# EAGLE design EN715_ExpansionBoard_ver1_1 (EAGLE 9.6.2)
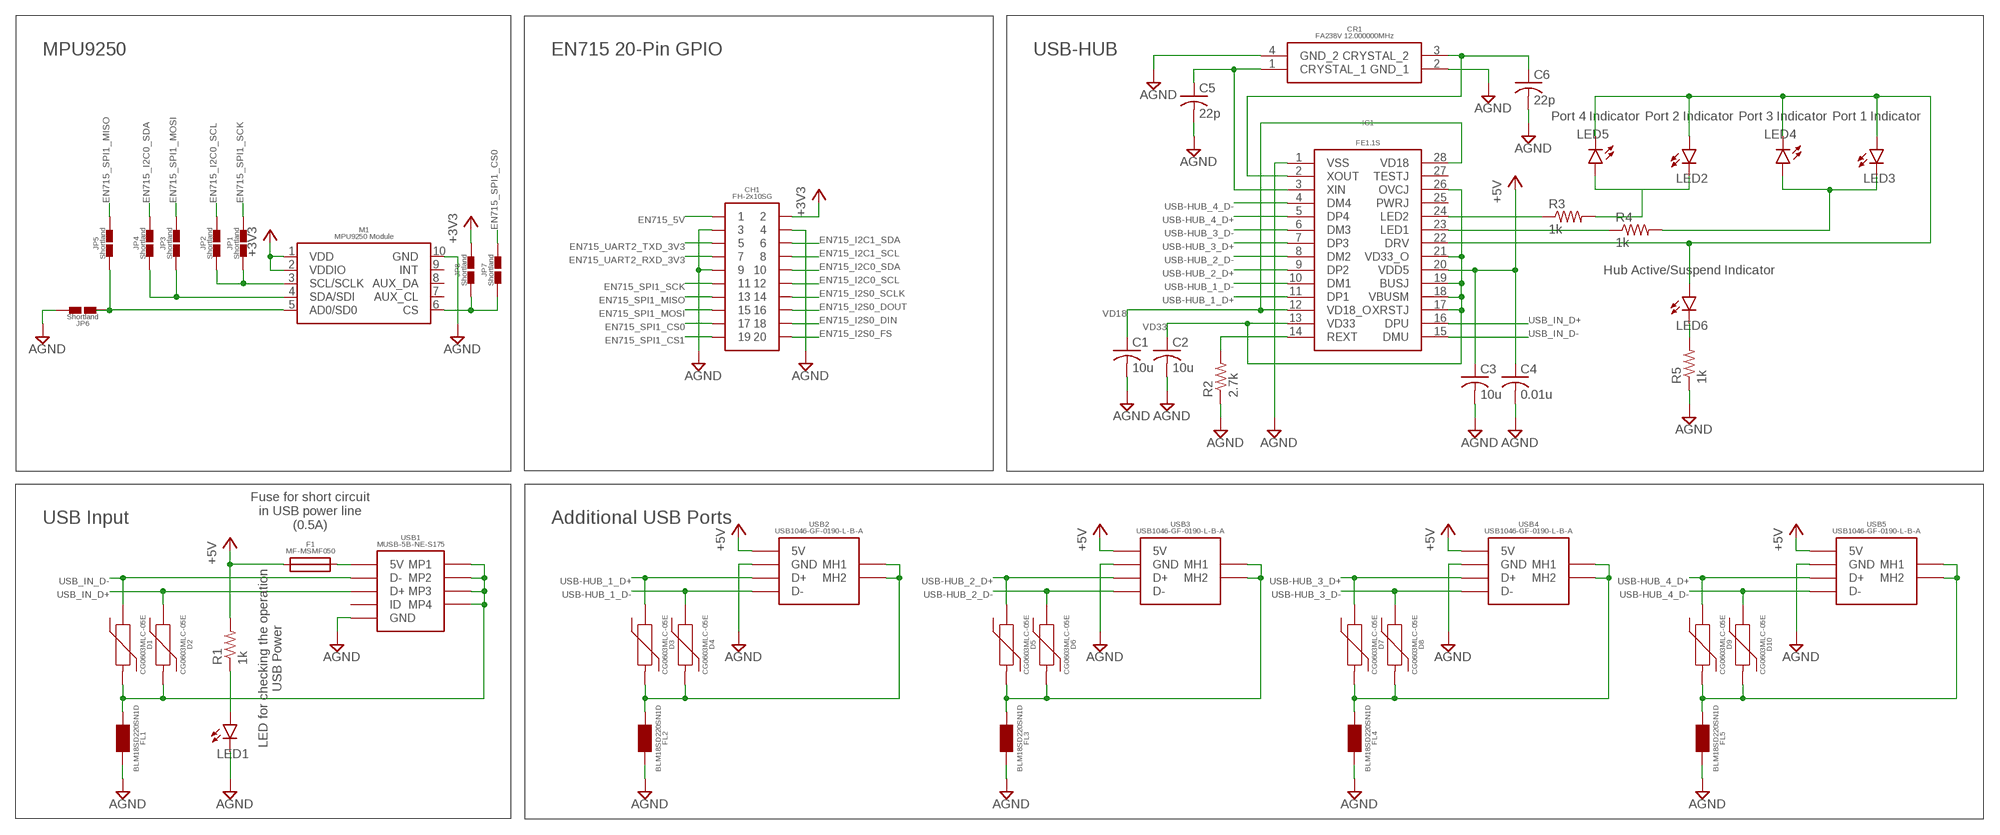
[diagram p0: schematic, sheet 1]

## Parts
C1  10u  C-USC0603  [C0603]
C2  10u  C-USC0603  [C0603]
C3  10u  C-USC0603  [C0603]
C4  0.01u  C-USC0603  [C0603]
C5  22p  C-USC0603  [C0603]
C6  22p  C-USC0603  [C0603]
CH1  2X10  [2X10]
CR1  FA238V_12.000000MHZ  [FA238V]
D1  CG0603MLC-05E  [CG0603MLC-05E]
D2  CG0603MLC-05E  [CG0603MLC-05E]
D3  CG0603MLC-05E  [CG0603MLC-05E]
D4  CG0603MLC-05E  [CG0603MLC-05E]
D5  CG0603MLC-05E  [CG0603MLC-05E]
D6  CG0603MLC-05E  [CG0603MLC-05E]
D7  CG0603MLC-05E  [CG0603MLC-05E]
D8  CG0603MLC-05E  [CG0603MLC-05E]
D9  CG0603MLC-05E  [CG0603MLC-05E]
D10  CG0603MLC-05E  [CG0603MLC-05E]
F1  MF-MSMF050  [MF-MSMF050]
FL1  BLM18SD220SN1D  [BLM18SD220SN1D]
FL2  BLM18SD220SN1D  [BLM18SD220SN1D]
FL3  BLM18SD220SN1D  [BLM18SD220SN1D]
FL4  BLM18SD220SN1D  [BLM18SD220SN1D]
FL5  BLM18SD220SN1D  [BLM18SD220SN1D]
IC1  FE1.1S  [FE1.1S]
JP1  SHORTLAND  [SHORTLAND]
JP2  SHORTLAND  [SHORTLAND]
JP3  SHORTLAND  [SHORTLAND]
JP4  SHORTLAND  [SHORTLAND]
JP5  SHORTLAND  [SHORTLAND]
JP6  SHORTLAND  [SHORTLAND]
JP7  SHORTLAND  [SHORTLAND]
JP8  SHORTLAND  [SHORTLAND]
LED1  LEDSML0603  [SML0603]
LED2  LEDSML0603  [SML0603]
LED3  LEDSML0603  [SML0603]
LED4  LEDSML0603  [SML0603]
LED5  LEDSML0603  [SML0603]
LED6  LEDSML0603  [SML0603]
M1  MPU9250_MODULE  [MPU9250_MODULE]
R1  1k  R-US_R0603  [R0603]
R2  2.7k  R-US_R0603  [R0603]
R3  1k  R-US_R0603  [R0603]
R4  1k  R-US_R0603  [R0603]
R5  1k  R-US_R0603  [R0603]
USB1  MINI_USB_B_SMD  [MINI_USB_B_SMD]
USB2  USB_A_X1_SMD  [USB_A_X1_SMD]
USB3  USB_A_X1_SMD  [USB_A_X1_SMD]
USB4  USB_A_X1_SMD  [USB_A_X1_SMD]
USB5  USB_A_X1_SMD  [USB_A_X1_SMD]

## Nets
+3V3 [USB-Power]: CH1.2 JP8.2 M1.1(VDD) M1.2(VDDIO)
+5V [USB-Power]: C3.1 C4.1 F1.1 IC1.20(VDD5) R1.2 USB2.1(5V) USB3.1(5V) USB4.1(5V) USB5.1(5V)
AGND [USB-Power]: C1.2 C2.2 C3.2 C4.2 C5.2 C6.2 CH1.3 CH1.4 CH1.9 CR1.2(GND_1) CR1.4(GND_2) FL1.2 FL2.2 FL3.2 FL4.2 FL5.2 IC1.1(VSS) JP6.2 LED1.C M1.10(GND) R2.1 R5.1 USB1.5(GND) USB2.4(GND) USB3.4(GND) USB4.4(GND) USB5.4(GND)
B_FUSE_USB_MINI_B [USB-Power]: F1.2 USB1.1(5V)
EN715_5V [USB-Power]: CH1.1
EN715_I2C0_SCL [USB-Data]: CH1.12 JP2.2
EN715_I2C0_SDA [USB-Data]: CH1.10 JP4.2
EN715_I2C1_SCL [USB-Data]: CH1.8
EN715_I2C1_SDA [USB-Data]: CH1.6
EN715_I2S0_DIN [USB-Data]: CH1.18
EN715_I2S0_DOUT [USB-Data]: CH1.16
EN715_I2S0_FS [USB-Data]: CH1.20
EN715_I2S0_SCLK [USB-Data]: CH1.14
EN715_SPI1_CS0 [USB-Data]: CH1.17 JP7.2
EN715_SPI1_CS1 [USB-Data]: CH1.19
EN715_SPI1_MISO [USB-Data]: CH1.13 JP5.2
EN715_SPI1_MOSI [USB-Data]: CH1.15 JP3.2
EN715_SPI1_SCK [USB-Data]: CH1.11 JP1.2
EN715_UART2_RXD_3V3 [USB-Data]: CH1.7
EN715_UART2_TXD_3V3 [USB-Data]: CH1.5
FE1.1S_DRV [USB-Power]: IC1.22(DRV) LED2.A LED3.A LED4.C LED5.C LED6.A
FE1.1S_DRV_LED_A [USB-Power]: LED6.C R5.2
FE1.1S_LED1_A [USB-Power]: LED3.C LED4.A R4.2
FE1.1S_LED_1_B [USB-Power]: IC1.23(LED1) R4.1
FE1.1S_LED_2_A [USB-Power]: LED2.C LED5.A R3.2
FE1.1S_LED_2_B [USB-Power]: IC1.24(LED2) R3.1
LED_USBIN [USB-Power]: LED1.A R1.1
MPU9250_AD0/SD0 [USB-Data]: JP5.1 JP6.1 M1.5(AD0/SD0)
MPU9250_CS [USB-Data]: JP7.1 JP8.1 M1.6(CS)
MPU9250_SCL/SCLK [USB-Data]: JP1.1 JP2.1 M1.3(SCL/SCLK)
MPU9250_SDA/SDI [USB-Data]: JP3.1 JP4.1 M1.4(SDA/SDI)
REXT_FE1.1S [USB-Data]: IC1.14(REXT) R2.2
USB-HUB_1_D+ [USB-Data]: D3.1 IC1.11(DP1) USB2.3(D+)
USB-HUB_1_D- [USB-Data]: D4.1 IC1.10(DM1) USB2.2(D-)
USB-HUB_2_D+ [USB-Data]: D5.1 IC1.9(DP2) USB3.3(D+)
USB-HUB_2_D- [USB-Data]: D6.1 IC1.8(DM2) USB3.2(D-)
USB-HUB_3_D+ [USB-Data]: D7.1 IC1.7(DP3) USB4.3(D+)
USB-HUB_3_D- [USB-Data]: D8.1 IC1.6(DM3) USB4.2(D-)
USB-HUB_4_D+ [USB-Data]: D9.1 IC1.5(DP4) USB5.3(D+)
USB-HUB_4_D- [USB-Data]: D10.1 IC1.4(DM4) USB5.2(D-)
USB_A_1_SHIELD [USB-Power]: D3.2 D4.2 FL2.1 USB2.MH1 USB2.MH2
USB_A_2_SHIELD [USB-Power]: D5.2 D6.2 FL3.1 USB3.MH1 USB3.MH2
USB_A_3_SHIELD [USB-Power]: D7.2 D8.2 FL4.1 USB4.MH1 USB4.MH2
USB_A_4_SHIELD [USB-Power]: D9.2 D10.2 FL5.1 USB5.MH1 USB5.MH2
USB_IN_D+ [USB-Data]: D2.1 IC1.16(DPU) USB1.3(D+)
USB_IN_D- [USB-Data]: D1.1 IC1.15(DMU) USB1.2(D-)
USB_MINI_B_SHIELD [USB-Power]: D1.2 D2.2 FL1.1 USB1.MP1 USB1.MP2 USB1.MP3 USB1.MP4
VD18 [USB-Power]: C1.1 IC1.12(VD18_O) IC1.28(VD18)
VD33 [USB-Power]: C2.1 IC1.13(VD33) IC1.17(XRSTJ) IC1.18(VBUSM) IC1.19(BUSJ) IC1.21(VD33_O) IC1.26(OVCJ)
XIN_FE1.1S [USB-Data]: C5.1 CR1.1(CRYSTAL_1) IC1.3(XIN)
XOUT_FE1.1S [USB-Data]: C6.1 CR1.3(CRYSTAL_2) IC1.2(XOUT)
Unconnected: IC1.25(PWRJ) IC1.27(TESTJ) M1.7(AUX_CL) M1.8(AUX_DA) M1.9(INT) USB1.4(ID)

## Notes on the sheet
- MPU9250 | EN715 20-Pin GPIO | USB-HUB
- Port 4 Indicator | Port 2 Indicator | Port 3 Indicator | Port 1 Indicator
- Hub Active/Suspend Indicator
- USB Input
- Fuse for short circuit
  in USB power line
  (0.5A)
- Additional USB Ports
- LED for checking the operation
  USB Power

## Library data of the parts
C1-C6 = rcl:C-US: CAPACITOR, American symbol; SPICEPREFIX: C
CH1 = Pin_socket:2X10
CR1 = FA238V:FA238V_12.000000MHZ
D1-D10 = CG0603MLC-05E:CG0603MLC-05E
F1 = MF-MSMF:MF-MSMF050
FL1-FL5 = BLM18SD220SN1D:BLM18SD220SN1D
IC1 = FE1.1S:FE1.1S
JP1-JP8 = Shortland:SHORTLAND
LED1-LED6 = led:LED: LED OSRAM: - CHIPLED LG R971, LG N971, LY N971, LG Q971, LY Q971, LO R971, LY R971 LH N974, LH R974 LS Q976, LO Q976, LY Q976 LO Q996 - Hyper CHIPLED LW Q18S LB Q993, LB Q99A, LB R99A - SideLED LS A670, LO A670, LY A670, LG A670, LP A670 LB A673, LV A673, LT A673, LW A673 LH A674 LY A675 LS A676, LA A676, LO A676, LY A676, LW A676 LS A679, LY A679, LG A679 - Hyper Micro SIDELED® LS Y876, LA Y876, LO Y876, LY Y876 LT Y87S - SmartLED LW L88C, LW L88S LB L89C, LB L89S, LG L890 LS L89K, LO L89K, LY L89K LS L896, LA L896, LO L896, LY L896 - TOPLED LS T670, LO T670, LY T670, LG T670, LP T670 LSG T670, LSP T670, LSY T670, LOP T670, LYG T670 LG T671, LOG T671, LSG T671 LB T673, LV T673, LT T673, LW T673 LH T674 LS T676, LA T676, LO T676, LY T676, LB T676, LH T676, LSB T676, LW T676 LB T67C, LV T67C, LT T67C, LS T67K, LO T67K, LY T67K, LW E67C LS E67B, LA E67B, LO E67B, LY E67B, LB E67C, LV E67C, LT E67C LW T67C LS T679, LY T679, LG T679 LS T770, LO T770, LY T770, LG T770, LP T770 LB T773, LV T773, LT T773, LW T773 LH T774 LS E675, LA E675, LY E675, LS T675 LS T776, LA T776, LO T776, LY T776, LB T776 LHGB T686 LT T68C, LB T68C - Hyper Mini TOPLED® LB M676 - Mini TOPLED Santana® LG M470 LS M47K, LO M47K, LY M47K Source: http://www.osram.convergy.de LUXEON: - LUMILED® LXK2-PW12-R00, LXK2-PW12-S00, LXK2-PW14-U00, LXK2-PW14-V00 LXK2-PM12-R00, LXK2-PM12-S00, LXK2-PM14-U00 LXK2-PE12-Q00, LXK2-PE12-R00, LXK2-PE12-S00, LXK2-PE14-T00, LXK2-PE14-U00 LXK2-PB12-K00, LXK2-PB12-L00, LXK2-PB12-M00, LXK2-PB14-N00, LXK2-PB14-P00, LXK2-PB14-Q00 LXK2-PR12-L00, LXK2-PR12-M00, LXK2-PR14-Q00, LXK2-PR14-R00 LXK2-PD12-Q00, LXK2-PD12-R00, LXK2-PD12-S00 LXK2-PH12-R00, LXK2-PH12-S00 LXK2-PL12-P00, LXK2-PL12-Q00, LXK2-PL12-R00 Source: www.luxeon.com KINGBRIGHT: KA-3528ASYC Source: www.kingbright.com
M1 = Strawberry-Linux_MPUP250_Module:MPU9250_MODULE
R1-R5 = rcl:R-US_: RESISTOR, American symbol; SPICEPREFIX: R
USB1 = USB_Connector:MINI_USB_B_SMD
USB2-USB5 = USB_Connector:USB_A_X1_SMD

## Net classes
1 USB-Data: width 0.254 mm, drill 0.127 mm, clearance 0.203 mm
2 USB-Power: width 0.254 mm, drill 0.127 mm, clearance 0.203 mm

## Board
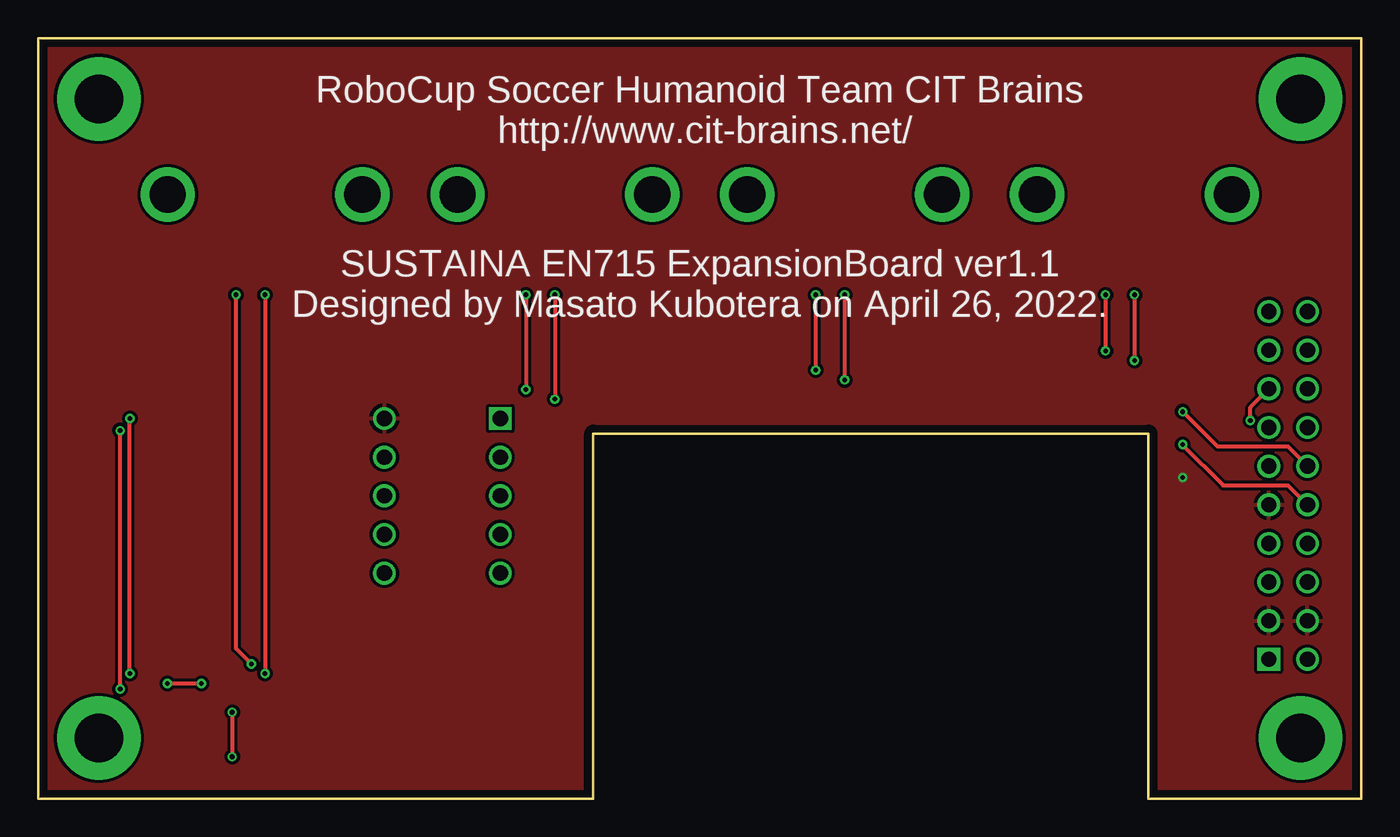
[diagram p1: board, top side]
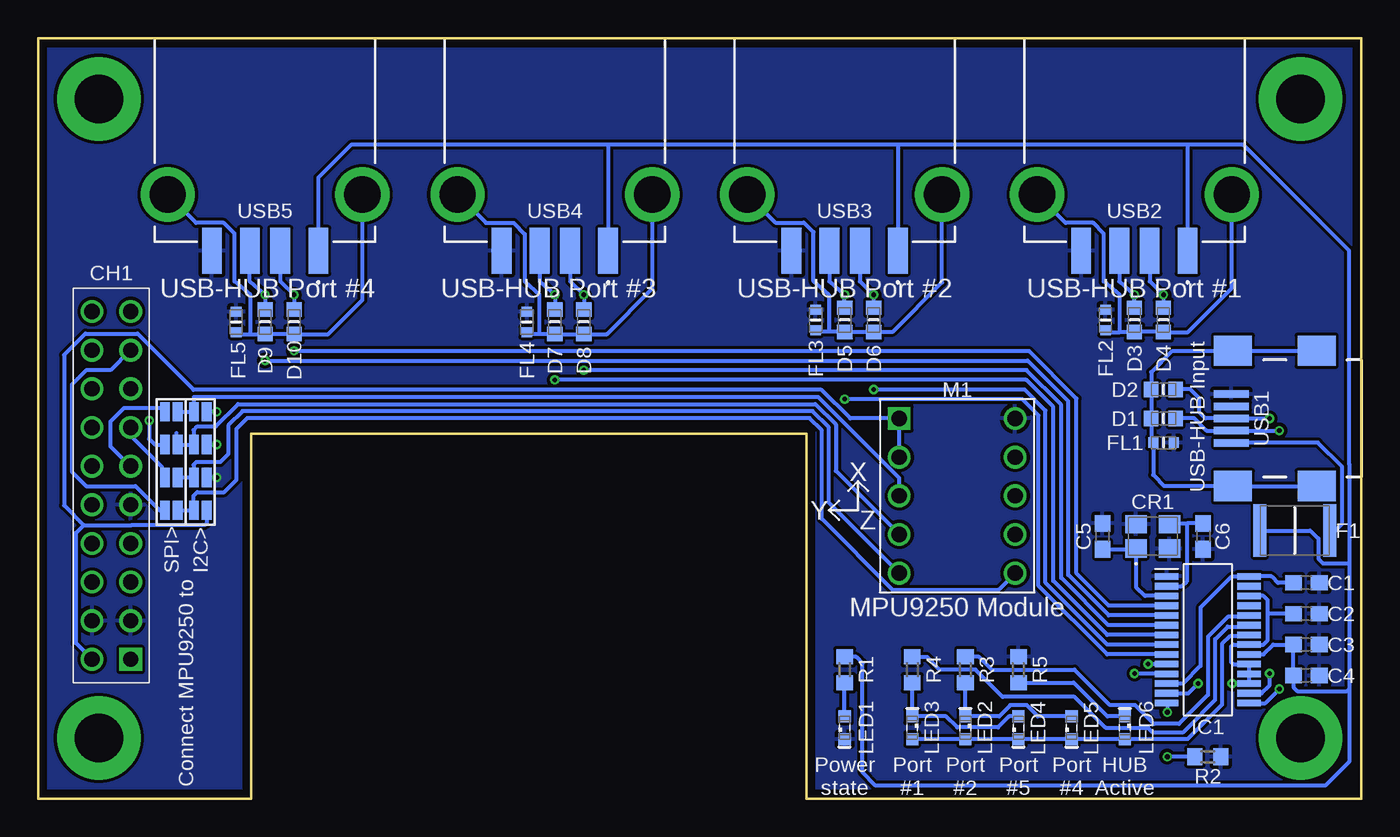
[diagram p2: board, bottom side, seen from below]

Size 87 x 50 mm. Coordinates in mm from the lower left corner, seen from the top.
Outline: 0,50 0,0 36.5,0 36.5,24 73,24 73,0 87,0 87,50 0,50
Copper layers (1*16): Top 0.035mm / dielectric 1.6mm / Bottom 0.035mm
Design rules "Elecrow_2-layer_PCB_eagle_rule": minimum track width 6mil, minimum drill 12mil, track to track 6mil, track to pad 6mil, pad to pad 6mil, via to via 8mil, smd to smd 0mil, copper to edge 20mil, drill to drill 10mil, minimum pad ring 6mil, minimum via ring 6mil, stop-mask expansion 0mil, vias tented up to drill 100mil, thermal gap 10mil

### Footprints (pad centres in the part's own frame; a part is rotated, then mirrored left to right if it is on the bottom)
C0603 = smd 1.1 x 1: 1 -0.85,0; 2 0.85,0
2X10 = drill 1 pad 1.5 square: 1 -11.43,-1.27 | drill 1 pad 1.5: 2 -11.43,1.27; 3 -8.89,-1.27; 4 -8.89,1.27; 5 -6.35,-1.27; 6 -6.35,1.27; 7 -3.81,-1.27; 8 -3.81,1.27; 9 -1.27,-1.27; 10 -1.27,1.27; 11 1.27,-1.27; 12 1.27,1.27; 13 3.81,-1.27; 14 3.81,1.27; 15 6.35,-1.27; 16 6.35,1.27; 17 8.89,-1.27; 18 8.89,1.27; 19 11.43,-1.27; 20 11.43,1.27
FA238V = smd 1.4 x 1.2: 1 -1.1,-0.8; 2 1.1,-0.8; 3 1.1,0.8; 4 -1.1,0.8
CG0603MLC-05E = smd 0.95 x 1: 1 -0.8,0; 2 0.8,0
MF-MSMF050 = smd 0.85 x 3.43: 1 -2.3,0; 2 2.3,0
BLM18SD220SN1D = smd 0.65 x 0.7: 1 -0.675,0; 2 0.675,0
FE1.1S = smd 1.525 x 0.44: 1 -2.712,4.16; 2 -2.712,3.52; 3 -2.712,2.88; 4 -2.712,2.24; 5 -2.712,1.6; 6 -2.712,0.96; 7 -2.712,0.32; 8 -2.712,-0.32; 9 -2.712,-0.96; 10 -2.712,-1.6; 11 -2.712,-2.24; 12 -2.712,-2.88; 13 -2.712,-3.52; 14 -2.712,-4.16; 15 2.712,-4.16; 16 2.712,-3.52; 17 2.712,-2.88; 18 2.712,-2.24; 19 2.712,-1.6; 20 2.712,-0.96; 21 2.712,-0.32; 22 2.712,0.32; 23 2.712,0.96; 24 2.712,1.6; 25 2.712,2.24; 26 2.712,2.88; 27 2.712,3.52; 28 2.712,4.16
SHORTLAND = smd 0.635 x 1.27: 1 -0.419,0; 2 0.419,0
SML0603 = smd 0.8 x 0.8: A 0.75,0; C -0.75,0
MPU9250_MODULE = drill 1 square: 1 -5.08,-3.81 | drill 1: 2 -2.54,-3.81; 3 0,-3.81; 4 2.54,-3.81; 5 5.08,-3.81; 6 5.08,3.81; 7 2.54,3.81; 8 0,3.81; 9 -2.54,3.81; 10 -5.08,3.81
R0603 = smd 1 x 1.1: 1 -0.85,0; 2 0.85,0
MINI_USB_B_SMD = smd 0.5 x 2.3: 1 -1.6,8.55; 2 -0.8,8.55; 3 0,8.55; 4 0.8,8.55; 5 1.6,8.55 | smd 2 x 2.5: MP1 -4.45,8.45; MP2 4.45,8.45; MP3 4.45,2.95; MP4 -4.45,2.95
USB_A_X1_SMD = smd 1.3 x 3: 1 -3.5,13.98; 2 -1,13.98; 3 1,13.98; 4 3.5,13.98 | drill 2.38 pad 3.57: MH1 -6.4,10.28; MH2 6.4,10.28

### Placement (x,y rotation side)
C1  3.62,14.21 0 bottom
C2  3.62,12.17 0 bottom
C3  3.62,10.14 0 bottom
C4  3.62,8.11 0 bottom
C5  17.02,17.25 90 bottom
C6  10.42,17.25 270 bottom
CH1  82.18,20.6 90 bottom
CR1  13.72,17.25 0 bottom
D1  13.02,25 180 bottom
D2  13.02,26.91 180 bottom
D3  14.93,31.48 270 bottom
D4  13.02,31.48 270 bottom
D5  33.98,31.48 270 bottom
D6  32.07,31.48 270 bottom
D7  53.02,31.35 270 bottom
D8  51.12,31.35 270 bottom
D9  72.08,31.35 270 bottom
D10  70.17,31.35 270 bottom
F1  4.38,17.63 0 bottom
FL1  13.02,23.41 0 bottom
FL2  16.83,31.48 90 bottom
FL3  35.88,31.48 90 bottom
FL4  54.87,31.35 90 bottom
FL5  73.98,31.35 90 bottom
IC1  10.1,10.46 0 bottom
JP1  78.23,25.44 180 bottom
JP2  76.33,25.44 0 bottom
JP3  78.23,23.29 180 bottom
JP4  76.33,23.29 0 bottom
JP5  78.23,21.13 180 bottom
JP6  76.33,21.13 0 bottom
JP7  78.23,18.97 180 bottom
JP8  76.33,18.97 0 bottom
LED1  33.98,4.68 90 bottom
LED2  26.04,4.68 270 bottom
LED3  29.53,4.68 270 bottom
LED4  22.55,4.68 90 bottom
LED5  19.05,4.68 90 bottom
LED6  15.56,4.68 270 bottom
M1  26.58,19.92 270 bottom
R1  33.98,8.49 90 bottom
R2  10.1,2.77 180 bottom
R3  26.04,8.49 270 bottom
R4  29.53,8.49 270 bottom
R5  22.55,8.49 270 bottom
USB1  0,25 90 bottom
USB2  14.93,50 180 bottom
USB3  33.98,50 180 bottom
USB4  53.02,50 180 bottom
USB5  72.08,50 180 bottom

### Tracks (layer width: path | path; a pad name or v marks a point on that pad's centre or on a via)
+3V3
  Bottom 0.254: M1.2 M1.1 33.61,25 35.49,26.89 76.78,26.89 80.46,30.57 83.9,30.57 85.28,29.18 85.28,19.29 84,18 | 84,18 80.84,18 | JP8.2 75.91,18.13 76.05,18 80.84,18 | 80.83,18 80.84,18 | 84,18 84.53,17.46 84.53,10.25 CH1.2
+5V
  Bottom 0.254: IC1.20 6.44,9.5 5.8,10.14 C3.1 C4.1 4.47,7.35 4.2,7.08 0.95,7.08 0.81,7.22 | R1.2 33.21,9.34 32.8,8.93 32.8,1.74 31.94,0.88 7.44,0.88 7.43,0.87 2.39,0.87 0.81,2.45 0.81,7.22 | 30.42,42.98 11.42,42.98 11.4,42.98 | 30.42,42.98 49.52,42.98 | USB5.1 68.58,40.83 66.42,42.98 49.52,42.98 | 30.42,42.98 30.48,42.92 USB3.1 | 49.52,42.98 USB4.1 | 11.4,42.98 7.78,42.98 0.81,36.02 0.81,22.01 | 0.81,22.01 0.83,22.03 | 0.81,22.01 0.81,15.47 | 0.81,15.47 0.81,7.22 | F1.1 3.37,17.63 2.84,17.11 2.84,15.78 2.53,15.47 0.81,15.47 | USB2.1 11.42,42.95 11.4,42.98
AGND  (via drill 0.3)
  Bottom 0.254: 2.8,12.49 C2.2
  other vias: 75.25,21.13
  pour Top: -0.95,51.03 -0.95,-1.04 37.42,-1.04 37.42,23.09 72.44,23.09 72.44,-1.04 87.95,-1.04 87.95,51.03
  pour Bottom: -1.59,51.67 -1.59,-1.67 38.05,-1.67 38.05,22.46 71.81,22.46 71.81,-1.67 88.59,-1.67 88.59,51.67
B_FUSE_USB_MINI_B
  Bottom 0.254: USB1.1 8.26,23.41 2.86,23.41 1.27,21.82 1.27,18.08 1.72,17.63 F1.2
EN715_I2C0_SCL  (via drill 0.3)
  Top 0.254: v75.25,25.45 77.55,23.15 82.18,23.15 83.19,22.14 CH1.12
  Bottom 0.254: v75.25,25.45 JP2.2
EN715_I2C0_SDA  (via drill 0.3)
  Top 0.254: v75.25,23.29 75.24,23.29 77.91,20.61 82.17,20.61 CH1.10
  Bottom 0.254: JP4.2 v75.25,23.29
EN715_SPI1_CS0
  Bottom 0.254: JP7.2 79,18.97 80.58,20.55 83.82,20.55 84.78,21.51 84.78,27.22 83.82,28.18 82.23,28.18 80.97,29.45 CH1.17
EN715_SPI1_MISO
  Bottom 0.254: CH1.13 80.91,23.86 78.87,21.82 78.87,21.19 JP5.2
EN715_SPI1_MOSI  (via drill 0.3)
  Top 0.254: CH1.15 79.69,25.73 v79.69,24.87
  Bottom 0.254: JP3.2 79.31,23.29 79.69,23.67 v79.69,24.87
EN715_SPI1_SCK
  Bottom 0.254: JP1.2 78.91,25.7 81.35,25.7 82.23,24.81 82.23,23.16 80.95,21.87 CH1.11
FE1.1S_DRV
  Bottom 0.254: LED3.A LED2.A LED4.C LED5.C LED6.A 11.43,3.93 9.17,6.2 9.17,10.19 8.67,10.69 7.48,10.69 IC1.22
FE1.1S_DRV_LED_A
  Bottom 0.254: R5.2 18.91,7.64 16.7,5.43 LED6.C
FE1.1S_LED1_A
  Bottom 0.254: LED4.A 23.16,5.43 23.9,4.7 26.57,4.7 27.3,5.43 LED3.C R4.2
FE1.1S_LED_1_B
  Bottom 0.254: IC1.23 7.48,11.33 8.79,11.33 9.62,10.5 9.62,6.51 11.4,4.68 11.7,4.39 13.74,4.39 14.04,4.68 16.83,4.68 18.86,6.71 23.59,6.71 25.37,8.49 27.73,8.49 28.56,9.34 R4.1
FE1.1S_LED_2_A
  Bottom 0.254: LED5.A 21.28,5.43 22.01,6.16 23.08,6.16 23.81,5.43 LED2.C R3.2
FE1.1S_LED_2_B
  Bottom 0.254: IC1.24 7.48,11.97 8.8,11.97 10.1,10.67 10.1,6.84 12,4.93 13.64,4.93 14.87,6.16 16.53,6.16 18.86,8.49 24.3,8.49 25.15,9.34 R3.1
LED_USBIN
  Bottom 0.254: LED1.A R1.1
MPU9250_AD0/SD0
  Bottom 0.254: JP5.1 77.81,21.1 77.8,21.09 77.77,21.13 JP6.1 | 76.65,21.19 JP6.1 | M1.5 35.02,19.47 35.02,24.42 36.09,25.49 73.56,25.49 74.49,24.55 74.49,22.65 75,22.14 76.58,22.14 76.77,21.95 76.77,21.13 JP6.1
MPU9250_CS
  Bottom 0.254: 77.92,18.97 JP7.1 JP8.1 76.77,18.99 76.77,19.92 76.53,20.16 74.75,20.16 73.97,20.95 73.97,24.3 73.24,25.02 36.27,25.02 35.48,24.22 35.48,18.4 30.84,13.76 23.85,13.76 M1.6
MPU9250_SCL/SCLK
  Bottom 0.254: 77.92,25.45 JP1.1 JP2.1 | 76.65,25.64 JP2.1 | M1.3 30.39,21.09 35.72,26.42 76.73,26.42 76.75,26.41 JP2.1
MPU9250_SDA/SDI
  Bottom 0.254: 77.92,24.05 77.92,23.41 JP3.1 JP4.1 76.77,23.31 76.77,24.24 76.53,24.48 75.32,24.48 73.85,25.95 35.89,25.95 34.56,24.61 34.56,21.55 M1.4
REXT_FE1.1S  (via drill 0.3)
  Top 0.254: v12.77,5.7 v12.77,2.77
  Bottom 0.254: IC1.14 12.77,6.25 v12.77,5.7 | R2.2 v12.77,2.77
S$1  (via drill 3.2 pad 5.5)
  other vias: 4,46
S$2  (via drill 3.2 pad 5.5)
  other vias: 83,46
S$3  (via drill 3.2 pad 5.5)
  other vias: 83,4
S$4  (via drill 3.2 pad 5.5)
  other vias: 4,4
USB-HUB_1_D+  (via drill 0.3)
  Top 0.254: v14.93,33.13 v14.93,8.24
  Bottom 0.254: 12.96,8.17 IC1.11 14.91,8.22 v14.93,8.24 | USB2.3 15.93,34.02 v14.93,33.13 D3.1
USB-HUB_1_D-  (via drill 0.3)
  Top 0.254: 13.02,9.87 v13.02,33.13 | 13.02,9.87 | v14.04,8.86 13.02,9.87
  Bottom 0.254: 13.91,36 USB2.2 13.93,34.02 v13.02,33.13 D4.1 | IC1.10 v14.04,8.86
USB-HUB_2_D+  (via drill 0.3)
  Top 0.254: v33.98,33.13 v33.98,26.27
  Bottom 0.254: IC1.9 16.72,9.5 21.22,14 21.22,25.2 22.29,26.27 v33.98,26.27 | D5.1 v33.98,33.13 34.98,34.02 USB3.3
USB-HUB_2_D-  (via drill 0.3)
  Top 0.254: v32.07,33.13 v32.07,26.91
  Bottom 0.254: 32.7,35.8 USB3.2 32.98,34.02 v32.07,33.13 D6.1 | IC1.8 16.71,10.14 20.77,14.19 20.77,25.51 22.16,26.91 v32.07,26.91
USB-HUB_3_D+  (via drill 0.3)
  Top 0.254: v53.02,33.13 v53.02,27.54
  Bottom 0.254: 53.98,36.11 USB4.3 54.02,34.02 v53.02,33.13 D7.1 53.34,32.3 | 12.96,10.71 IC1.7 16.71,10.78 20.26,14.33 20.26,25.76 22.04,27.54 v53.02,27.54
USB-HUB_3_D-  (via drill 0.3)
  Top 0.254: v51.12,33.13 v51.12,28.18
  Bottom 0.254: USB4.2 52.02,34.02 v51.12,33.13 D8.1 | IC1.6 16.62,11.42 19.73,14.53 19.73,25.89 22.02,28.18 v51.12,28.18
USB-HUB_4_D+  (via drill 0.3)
  Top 0.254: v72.08,33.13 v72.08,28.81
  Bottom 0.254: D9.1 v72.08,33.13 73.08,34.02 USB5.3 73.03,36.11 73.03,37.38 | IC1.5 16.62,12.06 19.27,14.72 19.27,26.14 21.94,28.81 v72.08,28.81
USB-HUB_4_D-  (via drill 0.3)
  Top 0.254: v70.17,33.13 v70.17,29.45
  Bottom 0.254: D10.1 v70.17,33.13 71.08,34.02 USB5.2 70.81,36.11 | IC1.4 16.61,12.7 18.74,14.83 18.74,26.31 21.88,29.45 v70.17,29.45
USB_A_1_SHIELD
  Bottom 0.254: 15.9,30.68 D3.2 14.86,30.71 13.27,30.71 D4.2 11.41,30.68 8.52,33.56 USB2.MH1 | USB2.MH2 19.45,37.85 17.64,37.85 16.94,37.15 16.94,34.02 15.9,33.13 15.9,30.68 | FL2.1 16.7,30.68 15.9,30.68
USB_A_2_SHIELD
  Bottom 0.254: 32.39,30.71 33.98,30.71 D5.2 34.01,30.71 35.01,30.71 | 32.39,30.71 30.8,30.71 27.57,33.94 USB3.MH1 | 32.39,30.71 D6.2 | 35.01,30.71 35.01,33.13 36.02,34.02 36.02,37.24 36.65,37.88 38.53,37.88 USB3.MH2 | 35.01,30.71 35.79,30.71 FL3.1
USB_A_3_SHIELD
  Bottom 0.254: USB4.MH1 46.62,33.52 49.6,30.55 D8.2 D7.2 | 54.05,30.55 54.05,33.13 55.01,34.02 55.01,37.12 55.74,37.85 57.55,37.85 USB4.MH2 | FL4.1 54.87,30.63 54.79,30.55 54.05,30.55 | D7.2 53.53,30.55 | D7.2 54.05,30.55
USB_A_4_SHIELD
  Bottom 0.254: 72.08,30.4 D9.2 | D9.2 D10.2 67.92,30.55 65.67,32.8 USB5.MH1 | 73.03,30.55 D9.2 | FL5.1 73.85,30.55 73.03,30.55 | USB5.MH2 76.6,37.85 74.79,37.85 74.09,37.15 74.09,34.02 73.03,33.13 73.03,30.55
USB_IN_D+  (via drill 0.3)
  Top 0.254: v6.03,8.24 v6.03,25
  Bottom 0.254: D2.1 11.24,26.91 10.66,26.33 10.66,25.41 10.25,25 USB1.3 v6.03,25 | v6.03,8.24 v6.04,8.23 6.04,7.48 6.58,6.94 IC1.16
USB_IN_D-  (via drill 0.3)
  Top 0.254: v5.4,7.22 v5.4,24.2
  Bottom 0.254: D1.1 10.99,25 10.19,24.2 USB1.2 5.44,24.2 v5.4,24.2 | IC1.15 6.32,6.3 v5.4,7.22
USB_MINI_B_SHIELD
  Bottom 0.254: USB1.MP3 3.18,29.45 8.26,29.45 USB1.MP2 8.58,29.45 12.42,29.45 13.82,28.05 D2.2 D1.2 13.82,23.54 FL1.1 13.7,21.29 12.96,20.55 8.58,20.55 USB1.MP1 8.26,20.55 3.18,20.55 USB1.MP4
VD18
  Bottom 0.254: C1.1 5.49,14.21 5.9,14.62 IC1.28 | IC1.28 7.42,14.66 | IC1.12 11.75,7.58 10.59,8.74 10.59,12.55 8.52,14.62 IC1.28
VD33  (via drill 0.3)
  Top 0.254: v10.73,7.58 v8.51,7.58
  Bottom 0.254: 6.16,12.17 6.16,10.43 6.45,10.14 7.56,10.14 | C2.1 6.16,12.17 | 7.56,10.14 8.45,10.14 8.58,10.01 8.58,9 8.44,8.86 IC1.19 IC1.18 IC1.17 v8.51,7.58 | 6.16,12.17 6.16,13.06 6.44,13.34 IC1.26 | IC1.13 11.4,6.94 10.76,7.58 v10.73,7.58 | IC1.21 7.56,10.08 7.56,10.14
XIN_FE1.1S
  Bottom 0.254: C5.1 14.87,16.4 CR1.1 14.82,13.92 14.23,13.34 IC1.3 12.9,13.43
XOUT_FE1.1S
  Bottom 0.254: 10.42,18.05 C6.1 11.5,18.1 | IC1.2 11.8,13.98 11.5,14.28 11.5,18.1 | CR1.3 12.57,18.1 11.5,18.1

### Text on the board
tPlace: RoboCup Soccer Humanoid Team CIT Brains / http://www.cit-brains.net/ | SUSTAINA EN715 ExpansionBoard ver1.1 / Designed by Masato Kubotera on April 26, 2022.
bPlace: USB-HUB Port #1 | USB-HUB Port #2 | USB-HUB Port #3 | USB-HUB Port #4 | USB-HUB Input | X | Y | Z | I2C> | Connect MPU9250 to | SPI> | MPU9250 Module | HUB / Active | Port / #4 | Port / #5 | Port / #2 | Port / #1 | Power / state